# Altium schematic sheet Capybara.SchDoc
size Letter; SheetNumber: 1; PageSetup: Record=PageOptions|CenterHorizontal=True|CenterVertical=True|PrintScale=0.98|XCorrection=1.00|YCorrection=1.00|PrintKind=0|BorderSize=5000000|LeftOffset=0|BottomOffset=0|Orientation=2|PaperLength=2794|PaperWidth=2159|Scale=100|PaperSource=7|PrintQuality=-3|MediaType=1|DitherType=10|PrintScaleMode=1|PaperKind=Letter|PaperIndex=1
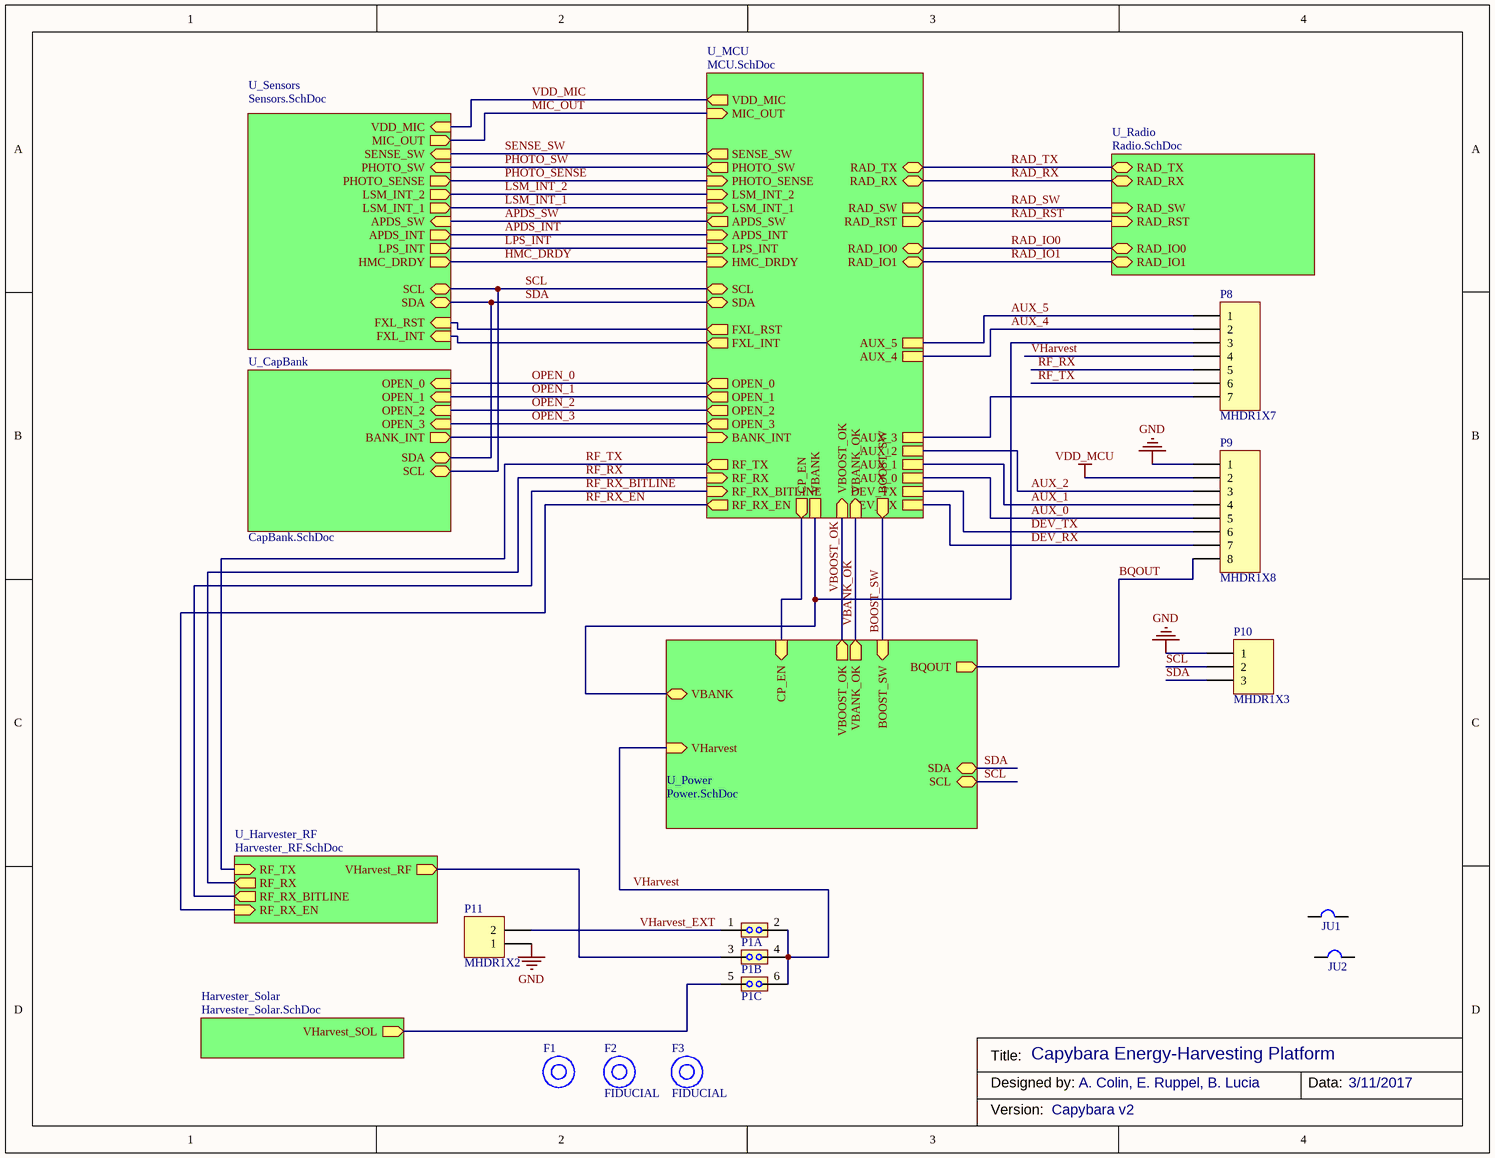
[diagram p0: Capybara.SchDoc]

## Parts
F1  FIDUCIAL  [FIDUCIAL]  (value not drawn)
F2  FIDUCIAL  [FIDUCIAL]
F3  FIDUCIAL  [FIDUCIAL]
JU1  JUMPER  [JUMPER0603]  (value not drawn)
JU2  JUMPER  [JUMPER0603]  (value not drawn)
P1  JMPHDR_12  [MHDR2X12]  (value not drawn)  (parts A,B,C of 12)
P8  MHDR1X7  [MHDR1X7]
P9  MHDR1X8  [MHDR1X8]
P10  MHDR1X3  [MHDR1X3]
P11  MHDR1X2  [MHDR1X2]

## Sub-sheets
Harvester_Solar = Harvester_Solar.SchDoc: VHarvest_SOL (out)
U_CapBank = CapBank.SchDoc: OPEN_1 (in), OPEN_2 (in), OPEN_3 (in), OPEN_0 (in), BANK_INT (out), SDA (bidir), SCL (bidir)
U_Harvester_RF = Harvester_RF.SchDoc: RF_TX (in), RF_RX_EN (in), RF_RX (out), RF_RX_BITLINE (out), VHarvest_RF (out)
U_MCU = MCU.SchDoc: AUX_2, AUX_1, AUX_0, AUX_3, AUX_4, AUX_5, APDS_INT (in), HMC_DRDY (in), LSM_INT_1 (in), OPEN_0 (out), OPEN_1 (out), OPEN_3 (out), OPEN_2 (out), RAD_TX (bidir), RAD_RX (bidir), DEV_TX, DEV_RX, VBANK_OK (in), VBOOST_OK (in), SCL (bidir), SDA (bidir), CP_EN (out), BOOST_SW (out), RAD_IO1 (bidir), RAD_IO0 (bidir), RAD_RST (out), RAD_SW (out), VBANK, LSM_INT_2 (in), APDS_SW (out), PHOTO_SW (out), RF_RX_EN (out), SENSE_SW (out), RF_RX (in), RF_RX_BITLINE (in), RF_TX (out), PHOTO_SENSE (in), LPS_INT (in), MIC_OUT (in), VDD_MIC (out), BANK_INT (in), FXL_RST (out), FXL_INT (out)
U_Power = Power.SchDoc: VBANK_OK (out), VBOOST_OK (out), BOOST_SW (in), VBANK, BQOUT (out), VHarvest (in), CP_EN (in), SDA (bidir), SCL (bidir)
U_Radio = Radio.SchDoc: RAD_RX (bidir), RAD_TX (bidir), RAD_SW (in), RAD_RST (in), RAD_IO0 (bidir), RAD_IO1 (bidir)
U_Sensors = Sensors.SchDoc: APDS_INT (out), SCL (bidir), SDA (bidir), SENSE_SW (in), PHOTO_SW (in), PHOTO_SENSE (out), APDS_SW (in), HMC_DRDY (out), LSM_INT_2 (out), LSM_INT_1 (out), LPS_INT (out), FXL_RST (in), FXL_INT (in), VDD_MIC (in), MIC_OUT (out)

## Nets
GND: P9.1 P10.1 P11.1
VDD_MCU: P9.2
APDS_INT: sheet U_Sensors/APDS_INT, sheet U_MCU/APDS_INT
APDS_SW: sheet U_Sensors/APDS_SW, sheet U_MCU/APDS_SW
AUX_0: P9.5 ; sheet U_MCU/AUX_0
AUX_1: P9.4 ; sheet U_MCU/AUX_1
AUX_2: P9.3 ; sheet U_MCU/AUX_2
AUX_4: P8.2 ; sheet U_MCU/AUX_4
AUX_5: P8.1 ; sheet U_MCU/AUX_5
BOOST_SW: sheet U_Power/BOOST_SW, sheet U_MCU/BOOST_SW
BQOUT: P9.8 ; sheet U_Power/BQOUT
DEV_RX: P9.7 ; sheet U_MCU/DEV_RX
DEV_TX: P9.6 ; sheet U_MCU/DEV_TX
HMC_DRDY: sheet U_Sensors/HMC_DRDY, sheet U_MCU/HMC_DRDY
LPS_INT: sheet U_Sensors/LPS_INT, sheet U_MCU/LPS_INT
LSM_INT_1: sheet U_Sensors/LSM_INT_1, sheet U_MCU/LSM_INT_1
LSM_INT_2: sheet U_Sensors/LSM_INT_2, sheet U_MCU/LSM_INT_2
MIC_OUT: sheet U_Sensors/MIC_OUT, sheet U_MCU/MIC_OUT
OPEN_0: sheet U_CapBank/OPEN_0, sheet U_MCU/OPEN_0
OPEN_1: sheet U_CapBank/OPEN_1, sheet U_MCU/OPEN_1
OPEN_2: sheet U_CapBank/OPEN_2, sheet U_MCU/OPEN_2
OPEN_3: sheet U_CapBank/OPEN_3, sheet U_MCU/OPEN_3
PHOTO_SENSE: sheet U_Sensors/PHOTO_SENSE, sheet U_MCU/PHOTO_SENSE
PHOTO_SW: sheet U_Sensors/PHOTO_SW, sheet U_MCU/PHOTO_SW
RAD_IO0: sheet U_Radio/RAD_IO0, sheet U_MCU/RAD_IO0
RAD_IO1: sheet U_Radio/RAD_IO1, sheet U_MCU/RAD_IO1
RAD_RST: sheet U_Radio/RAD_RST, sheet U_MCU/RAD_RST
RAD_RX: sheet U_Radio/RAD_RX, sheet U_MCU/RAD_RX
RAD_SW: sheet U_Radio/RAD_SW, sheet U_MCU/RAD_SW
RAD_TX: sheet U_Radio/RAD_TX, sheet U_MCU/RAD_TX
RF_RX: P8.5 ; sheet U_Harvester_RF/RF_RX, sheet U_MCU/RF_RX
RF_RX_BITLINE: sheet U_Harvester_RF/RF_RX_BITLINE, sheet U_MCU/RF_RX_BITLINE
RF_RX_EN: sheet U_Harvester_RF/RF_RX_EN, sheet U_MCU/RF_RX_EN
RF_TX: P8.6 ; sheet U_Harvester_RF/RF_TX, sheet U_MCU/RF_TX
SCL: P10.2 ; sheet U_CapBank/SCL, sheet U_Sensors/SCL, sheet U_Power/SCL, sheet U_MCU/SCL
SDA: P10.3 ; sheet U_CapBank/SDA, sheet U_Sensors/SDA, sheet U_Power/SDA, sheet U_MCU/SDA
SENSE_SW: sheet U_Sensors/SENSE_SW, sheet U_MCU/SENSE_SW
VBANK_OK: sheet U_Power/VBANK_OK, sheet U_MCU/VBANK_OK
VBOOST_OK: sheet U_Power/VBOOST_OK, sheet U_MCU/VBOOST_OK
VDD_MIC: sheet U_Sensors/VDD_MIC, sheet U_MCU/VDD_MIC
VHarvest: P1.2 P1.4 P1.6 P8.4 ; sheet U_Power/VHarvest
VHarvest_EXT: P1.1 P11.2
NetP1_3: P1.3 ; sheet U_Harvester_RF/VHarvest_RF
NetP1_5: P1.5 ; sheet Harvester_Solar/VHarvest_SOL
NetP8_3: P8.3 ; sheet U_Power/VBANK, sheet U_MCU/VBANK
NetP8_7: P8.7 ; sheet U_MCU/AUX_3
(unnamed): sheet U_CapBank/BANK_INT, sheet U_MCU/BANK_INT
(unnamed): sheet U_Sensors/FXL_RST, sheet U_MCU/FXL_RST
(unnamed): sheet U_Sensors/FXL_INT, sheet U_MCU/FXL_INT
(unnamed): sheet U_Power/CP_EN, sheet U_MCU/CP_EN

Not connected (* = marked no-connect by the designer): JU1 1 2; JU2 1 2

## Notes on the sheet
- Title:
- Designed by:
- Capybara Energy-Harvesting Platform
- A. Colin, E. Ruppel, B. Lucia
- Data:
- 3/11/2017
- Version:
- Capybara v2

## Library data of the parts
P1 = JMPHDR_12: Manufacturer: Sullins Connector Solutions; Manufacturer Part Number: GRPB122VWVN-RC; Digi-Key Part Number: S9015E-12-ND; Distributor: Digikey; Distributor Part Number: S9015E-12-ND
P8 = MHDR1X7: Header, 7-Pin; Manufacturer Part Number: M52-5000745; Manufacturer: Harwin Inc.; LatestRevisionDate: 17-Jul-2002; LatestRevisionNote: Re-released for DXP Platform.; Publisher: Altium Limited; Digi-Key Part Number: 952-3360-ND; Distributor: Mouser; Distributor Part Number: 855-M52-5000745; Mouser Part Number: 855-M52-5000745
P9 = MHDR1X8: Header, 8-Pin; Manufacturer: Harwin Inc.; Manufacturer Part Number: M52-5000845; LatestRevisionDate: 17-Jul-2002; LatestRevisionNote: Re-released for DXP Platform.; Publisher: Altium Limited; Digi-Key Part Number: 952-3361-ND; Distributor: Mouser; Distributor Part Number: 855-M52-5000845; Mouser Part Number: 855-M52-5000845
P10 = MHDR1X3: Header, 3-Pin; Manufacturer: Harwin Inc.; Manufacturer Part Number: M52-5000345; LatestRevisionDate: 17-Jul-2002; LatestRevisionNote: Re-released for DXP Platform.; Publisher: Altium Limited; Digi-Key Part Number: 952-3357-ND; Distributor: Mouser; Distributor Part Number: 855-M52-5000345; Mouser Part Number: 855-M52-5000345
P11 = MHDR1X2: Header, 2-Pin; Manufacturer: Samtec Inc.; Manufacturer Part Number: SLM-102-01-S-S; LatestRevisionDate: 17-Jul-2002; LatestRevisionNote: Re-released for DXP Platform.; Publisher: Altium Limited; Digi-Key Part Number: SAM9931-ND; Distributor: Digikey; Distributor Part Number: SAM9931-ND